# EAGLE design HUMA (EAGLE 5.10)
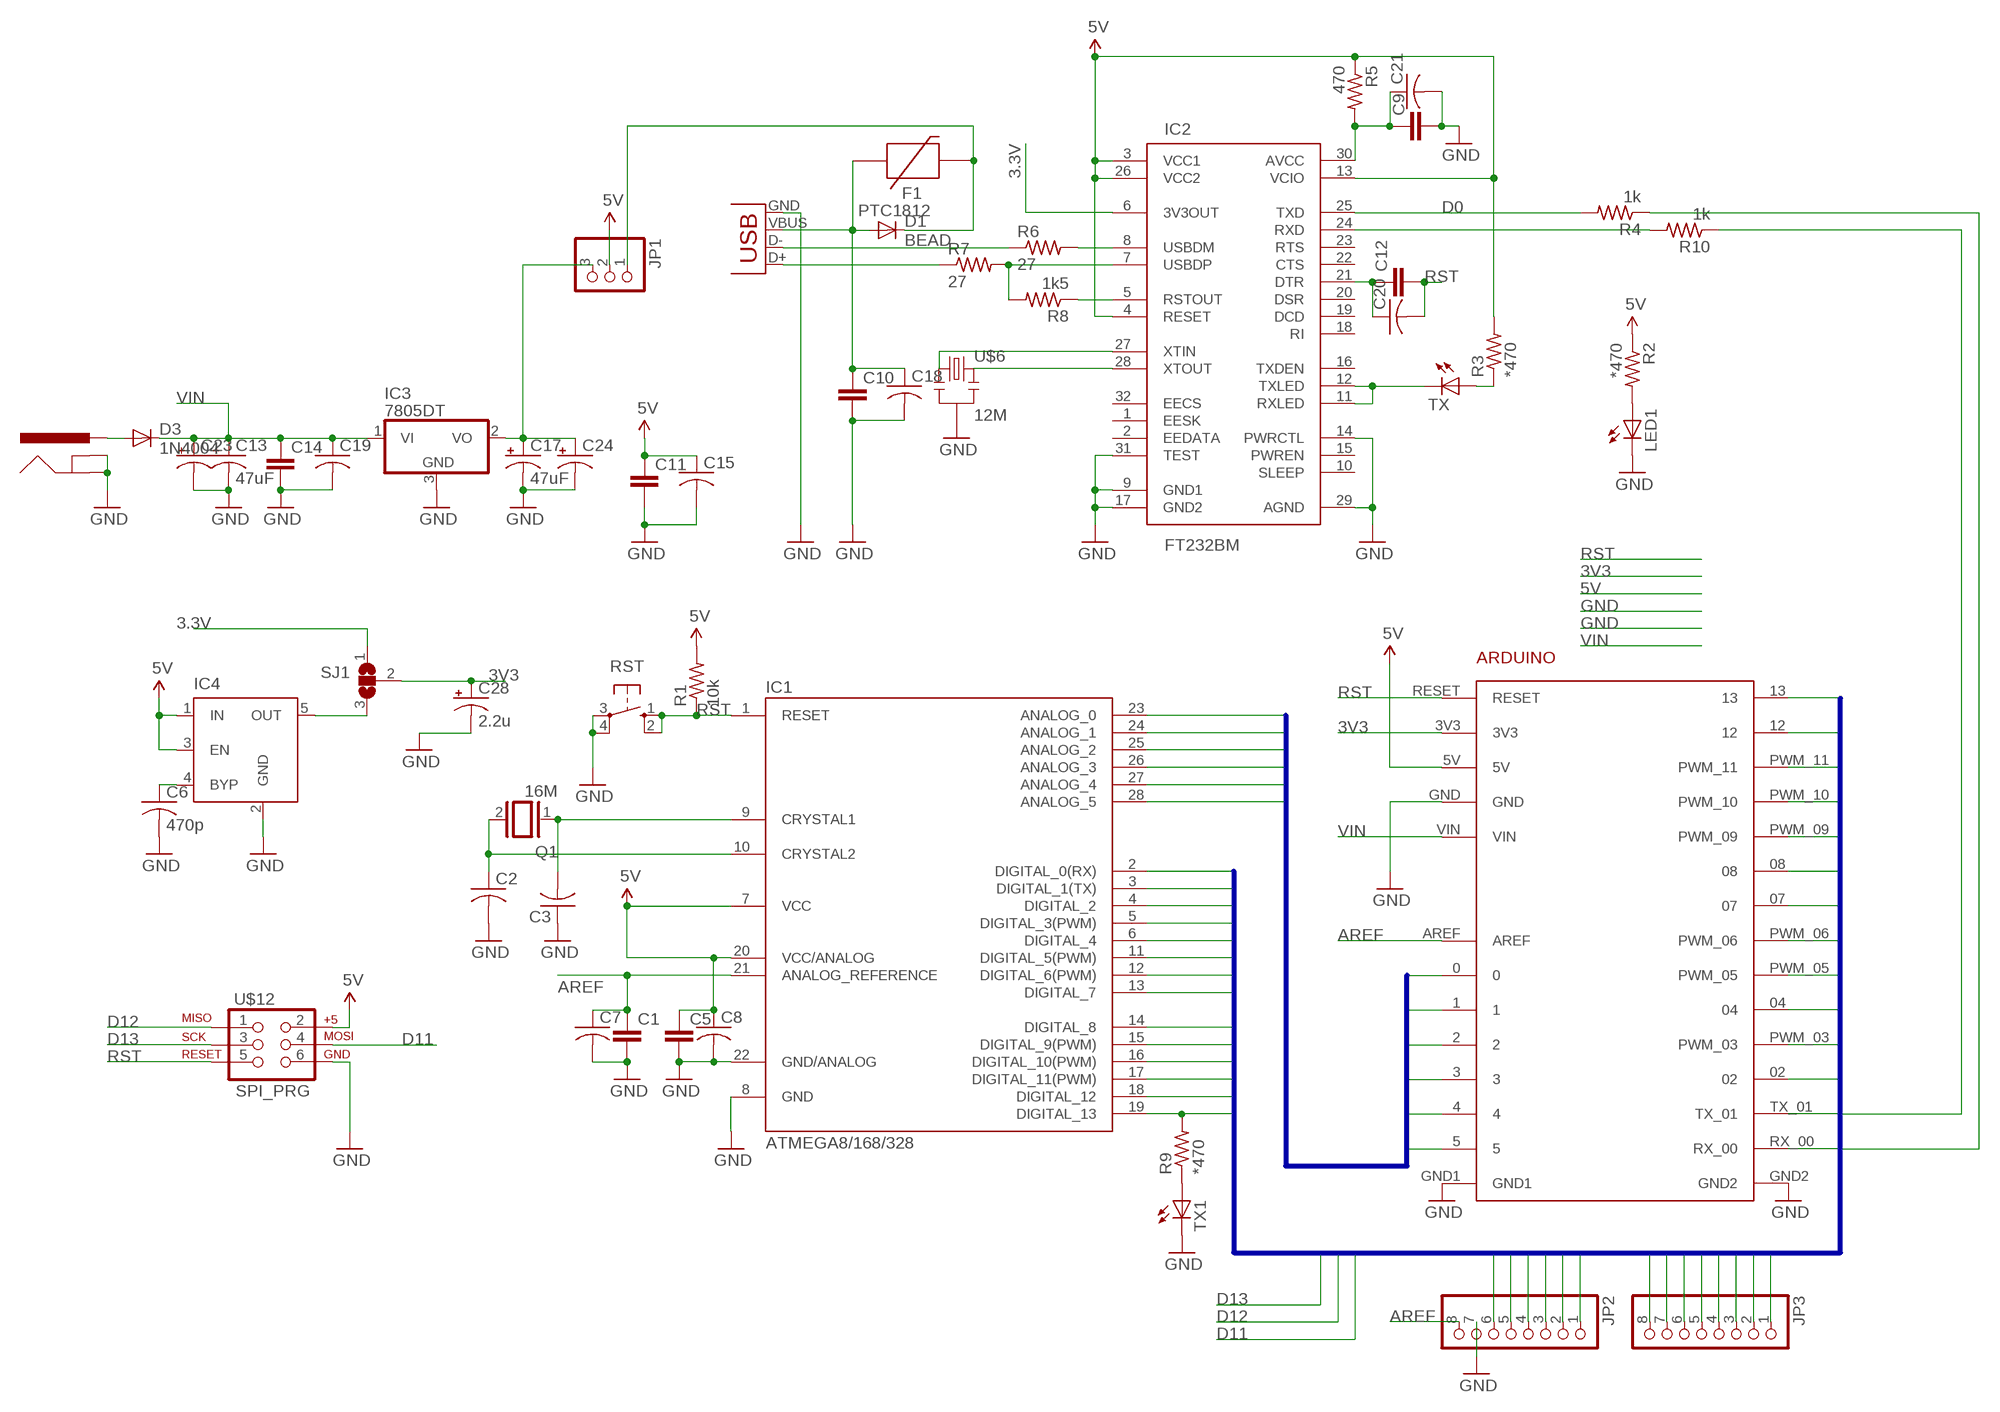
[diagram p0: schematic, sheet 1]

## Parts
ARDUINO1  ARDUINO2  [ARDUINO2]
C1  C5/2.5  [C5B2.5]
C2  C-US025-025X050  [C025-025X050]
C3  C-US025-025X050  [C025-025X050]
C5  C5/2.5  [C5B2.5]
C6  470p  C-US025-025X050  [C025-025X050]
C7  C-USC0603K  [C0603K]
C8  C-USC0603K  [C0603K]
C9  C5/2.5  [C5B2.5]
C10  C5/2.5  [C5B2.5]
C11  C5/2.5  [C5B2.5]
C12  C5/2.5  [C5B2.5]
C13  47uF  CPOL-USE2.5-7  [E2,5-7]
C14  C5/2.5  [C5B2.5]
C15  C-USC0603K  [C0603K]
C17  47uF  CPOL-USE2.5-7  [E2,5-7]
C18  C-USC0603K  [C0603K]
C19  C-USC0603K  [C0603K]
C20  C-USC0603K  [C0603K]
C21  C-USC0603K  [C0603K]
C23  CPOL-US153CLV-0605  [153CLV-0605]
C24  CPOL-US153CLV-0605  [153CLV-0605]
C28  2.2u  CPOL-USA/3216-18W  [A/3216-18W]
D1  BEAD  1N4004  [DO41-10]
D3  1N4004  [DO41-10]
F1  PTC1812  [C1812]
IC1  ATMEGA8/168/328  ATMEGA168-PU  [DIL28-3]
IC2  FT232BM  [QFP-32]
IC3  7805DT  [TO252]
IC4  MIC5219XX  [SOT23-5]
J1  POWER_JACKPTH  [POWER_JACK_PTH]
JP1  PINHD-1X3  [1X03]
JP2  PINHD-1X8  [1X08]
JP3  PINHD-1X8  [1X08]
LED1  LED3MM  [LED3MM]
Q1  16M  XTAL/S  [QS]
R1  10k  R-US_0207/7  [0207/7]
R2  *470  R-US_0207/7  [0207/7]
R3  *470  R-US_0207/7  [0207/7]
R4  1k  R-US_0207/7  [0207/7]
R5  470  R-US_0207/7  [0207/7]
R6  27  R-US_0207/7  [0207/7]
R7  27  R-US_0207/7  [0207/7]
R8  1k5  R-US_0207/7  [0207/7]
R9  *470  R-US_0207/7  [0207/7]
R10  1k  R-US_0207/7  [0207/7]
RST  10-XX  [B3F-10XX]
SJ1  SOLDERJUMPER_2WAYT  [SJ_2]
TX  LED3MM  [LED3MM]
TX1  LED3MM  [LED3MM]
U$6  12M  RESONATORPTH  [RESONATOR-PTH]
U$12  SPI_PRG  AVR_SPI_PRG_6PTH  [2X3]
X1  USB  [USB-B-PTH]

## Nets
3.3V: IC2.6(3V3OUT) SJ1.1
3V3: ARDUINO1.3V3 C28.+ SJ1.2
5V: ARDUINO1.5V C5.1 C8.1 C11.1 C15.1 IC1.7(VCC) IC1.20(VCC/ANALOG) IC2.3(VCC1) IC2.4(RESET) IC2.13(VCIO) IC2.26(VCC2) IC4.1(IN) IC4.3(EN) JP1.2 R1.2 R2.1 R3.2 R5.1 U$12.2
A0: ARDUINO1.0 IC1.23(ANALOG_0)
A1: ARDUINO1.1 IC1.24(ANALOG_1)
A2: ARDUINO1.2 IC1.25(ANALOG_2)
A3: ARDUINO1.3 IC1.26(ANALOG_3)
A4: ARDUINO1.4 IC1.27(ANALOG_4)
A5: ARDUINO1.5 IC1.28(ANALOG_5)
AREF: ARDUINO1.AREF C1.1 C7.1 IC1.21(ANALOG_REFERENCE) JP2.8
D0: ARDUINO1.RX_00 IC1.2(DIGITAL_0(RX)) JP3.1 R4.1
D1: ARDUINO1.TX_01 IC1.3(DIGITAL_1(TX)) JP3.2 R10.1
D2: ARDUINO1.02 IC1.4(DIGITAL_2) JP3.3
D3: ARDUINO1.PWM_03 IC1.5(DIGITAL_3(PWM)) JP3.4
D4: ARDUINO1.04 IC1.6(DIGITAL_4) JP3.5
D5: ARDUINO1.PWM_05 IC1.11(DIGITAL_5(PWM)) JP3.6
D6: ARDUINO1.PWM_06 IC1.12(DIGITAL_6(PWM)) JP3.7
D7: ARDUINO1.07 IC1.13(DIGITAL_7) JP3.8
D8: ARDUINO1.08 IC1.14(DIGITAL_8) JP2.1
D9: ARDUINO1.PWM_09 IC1.15(DIGITAL_9(PWM)) JP2.2
D10: ARDUINO1.PWM_10 IC1.16(DIGITAL_10(PWM)) JP2.3
D11: ARDUINO1.PWM_11 IC1.17(DIGITAL_11(PWM)) JP2.4 U$12.4
D12: ARDUINO1.12 IC1.18(DIGITAL_12) JP2.5 U$12.1
D13: ARDUINO1.13 IC1.19(DIGITAL_13) JP2.6 R9.2 U$12.3
GND: ARDUINO1.GND ARDUINO1.GND1 ARDUINO1.GND2 C1.2 C2.2 C3.1 C5.2 C6.2 C7.2 C8.2 C9.2 C10.2 C11.2 C13.- C14.2 C15.2 C17.- C18.2 C19.2 C21.2 C23.- C24.- C28.- IC1.8(GND) IC1.22(GND/ANALOG) IC2.9(GND1) IC2.14(PWRCTL) IC2.17(GND2) IC2.29(AGND) IC2.31(TEST) IC3.3(GND) IC4.2(GND) J1.GND J1.GNDBREAK JP2.7 LED1.K(C) RST.3(P) RST.4(P1) TX1.K(C) U$6.2 U$12.6 X1.GND
N$1: D1.C F1.2 JP1.1
N$2: C12.1 C20.1 IC2.21(DTR)
N$3: D3.A J1.PWR
N$4: C17.+ C24.+ IC3.2(VO) JP1.3
N$5: IC2.28(XTOUT) U$6.3
N$6: IC2.24(RXD) R10.2
N$7: IC2.25(TXD) R4.2
N$10: IC4.5(OUT) SJ1.3
N$13: R9.1 TX1.A
N$14: C6.1 IC4.4(BYP)
N$21: LED1.A R2.2
N$22: C3.2 IC1.9(CRYSTAL1) Q1.1
N$23: C2.1 IC1.10(CRYSTAL2) Q1.2
N$24: R6.1 X1.D-
N$25: R7.1 X1.D+
N$27: R3.1 TX.A
N$30: IC2.11(RXLED) IC2.12(TXLED) TX.K(C)
N$32: IC2.27(XTIN) U$6.1
N$33: C9.1 C21.1 IC2.30(AVCC) R5.2
N$34: IC2.7(USBDP) R7.2 R8.2
N$35: IC2.8(USBDM) R6.2
N$36: IC2.5(RSTOUT) R8.1
RST: ARDUINO1.RESET C12.2 C20.2 IC1.1(RESET) R1.1 RST.1(S) RST.2(S1) U$12.5
VBUS: C10.1 C18.1 D1.A F1.1 X1.VBUS
VIN: ARDUINO1.VIN C13.+ C14.1 C19.1 C23.+ D3.C IC3.1(VI)
Unconnected: IC2.1(EESK) IC2.2(EEDATA) IC2.10(SLEEP) IC2.15(PWREN) IC2.16(TXDEN) IC2.18(RI) IC2.19(DCD) IC2.20(DSR) IC2.22(CTS) IC2.23(RTS) IC2.32(EECS)

## Buses
D[0..13]
A[0..5]

## Library data of the parts
ARDUINO1 = arduino:ARDUINO: For creating Arduino shields
C1 C5 C9-C12 C14 = capacitor-wima:C: CAPACITOR naming: grid - package width
C2 C3 = rcl:C-US: CAPACITOR, American symbol
C6-C8 C15 C18-C21 = rcl-ez:C-US: CAPACITOR, American symbol
C13 C17 C23 C24 = rcl:CPOL-US: POLARIZED CAPACITOR, American symbol
C28 = rcl-ez:CPOL-US: POLARIZED CAPACITOR, American symbol
D1 D3 = diode:1N4004: DIODE general purpose rectifier, 1 A
F1 = SparkFunEagle-6-6-07:PTC: Resettable Fuse PTC Resettable Fuse. Spark Fun Electronics SKU : COM-08357
IC1 = Arduino-AVR:ATMEGA168-PU
IC2 = FTDI:FT232BM: FT232BM USB-RS232 Wandler FTDI
IC3 = linear:78*: Positive VOLTAGE REGULATOR Source: http://cache.national.com/ds/LM/LM78L05.pdf http://www.fairchildsemi.com/ds/LM/LM7805.pdf
IC4 = v-reg-micrel:MIC5219XX: VOLTAGE REGULATOR
J1 = SparkFun:POWER_JACK: Power Jack This is the standard 5.5mm barrel jack for power. The PTH is the most common, proven, reliable, footprint. All others are experimental. The Slot footprint only works if the mill layer is transmitted to the PCB fab house so be warned. Spark Fun Electronics SKU : PRT-00119. Mating wall wart : TOL-00298 (and others)
JP1 = pinhead:PINHD-1X3: PIN HEADER
JP2 JP3 = pinhead:PINHD-1X8: PIN HEADER
LED1 TX TX1 = led:LED: LED OSRAM: - CHIPLED LG R971, LG N971, LY N971, LG Q971, LY Q971, LO R971, LY R971 LH N974, LH R974 LS Q976, LO Q976, LY Q976 LO Q996 - Hyper CHIPLED LW Q18S LB Q993, LB Q99A, LB R99A - SideLED LS A670, LO A670, LY A670, LG A670, LP A670 LB A673, LV A673, LT A673, LW A673 LH A674 LY A675 LS A676, LA A676, LO A676, LY A676, LW A676 LS A679, LY A679, LG A679 - Hyper Micro SIDELED® LS Y876, LA Y876, LO Y876, LY Y876 LT Y87S - SmartLED LW L88C, LW L88S LB L89C, LB L89S, LG L890 LS L89K, LO L89K, LY L89K LS L896, LA L896, LO L896, LY L896 - TOPLED LS T670, LO T670, LY T670, LG T670, LP T670 LSG T670, LSP T670, LSY T670, LOP T670, LYG T670 LG T671, LOG T671, LSG T671 LB T673, LV T673, LT T673, LW T673 LH T674 LS T676, LA T676, LO T676, LY T676, LB T676, LH T676, LSB T676, LW T676 LB T67C, LV T67C, LT T67C, LS T67K, LO T67K, LY T67K, LW E67C LS E67B, LA E67B, LO E67B, LY E67B, LB E67C, LV E67C, LT E67C LW T67C LS T679, LY T679, LG T679 LS T770, LO T770, LY T770, LG T770, LP T770 LB T773, LV T773, LT T773, LW T773 LH T774 LS E675, LA E675, LY E675, LS T675 LS T776, LA T776, LO T776, LY T776, LB T776 LHGB T686 LT T68C, LB T68C - Hyper Mini TOPLED® LB M676 - Mini TOPLED Santana® LG M470 LS M47K, LO M47K, LY M47K Source: http://www.osram.convergy.de - LUMILED® LXK2-PW12-R00, LXK2-PW12-S00, LXK2-PW14-U00, LXK2-PW14-V00 LXK2-PM12-R00, LXK2-PM12-S00, LXK2-PM14-U00 LXK2-PE12-Q00, LXK2-PE12-R00, LXK2-PE12-S00, LXK2-PE14-T00, LXK2-PE14-U00 LXK2-PB12-K00, LXK2-PB12-L00, LXK2-PB12-M00, LXK2-PB14-N00, LXK2-PB14-P00, LXK2-PB14-Q00 LXK2-PR12-L00, LXK2-PR12-M00, LXK2-PR14-Q00, LXK2-PR14-R00 LXK2-PD12-Q00, LXK2-PD12-R00, LXK2-PD12-S00 LXK2-PH12-R00, LXK2-PH12-S00 LXK2-PL12-P00, LXK2-PL12-Q00, LXK2-PL12-R00 Source: www.luxeon.com
Q1 = special:XTAL/S: CRYSTAL
R1 R2 = rcl:R-US_: RESISTOR, American symbol
R3-R10 = resistor:R-US_: RESISTOR, American symbol
RST = switch-omron:10-XX: OMRON SWITCH
SJ1 = SparkFun:SOLDERJUMPER_2WAY: Solder Jumper 2 way solder jumper
U$6 = SparkFun:RESONATOR: Resonator Small SMD resonator. This is the itty bitty 10/20MHz resonators with built in caps. CSTCE10M0G55 and CSTCE20M0V53. Footprint has been reviewed closely but hasn't been tested yet.
U$12 = SparkFun:AVR_SPI_PRG_6: AVR ISP 6 Pin This is the reduced ISP connector for AVR programming. Common on Arduino. This footprint will take up less PCB space and can be used with a 10-pin to 6-pin adapter such as SKU: BOB-08508
X1 = SparkFun:USB: USB Connectors USB-B-PTH is fully proven SKU : PRT-00139 USB-miniB is fully proven SKU : PRT-00587 USB-A-H is throughly reviewed, but untested. Spark Fun Electronics SKU : PRT-00437 USB-B-SMT is throughly reviewed, but untested. Needs silkscreen touching up. USB-A-S has not been used/tested USB-MB-H has not been used/tested

## Board
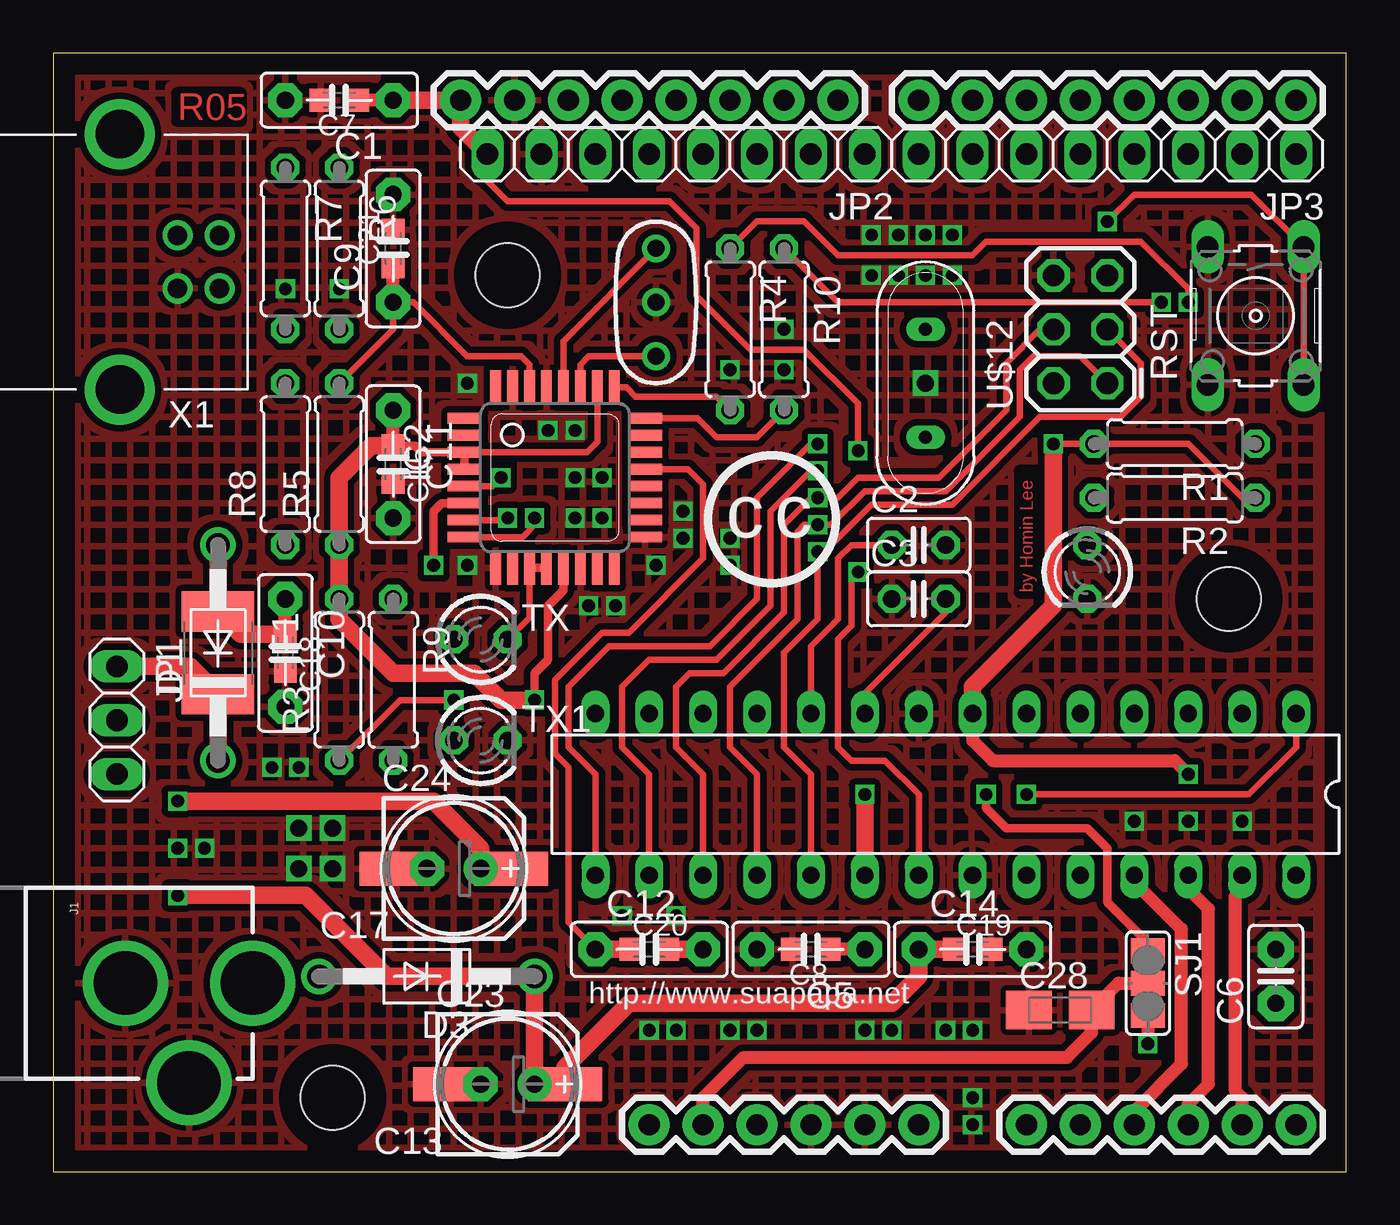
[diagram p1: board, top side]
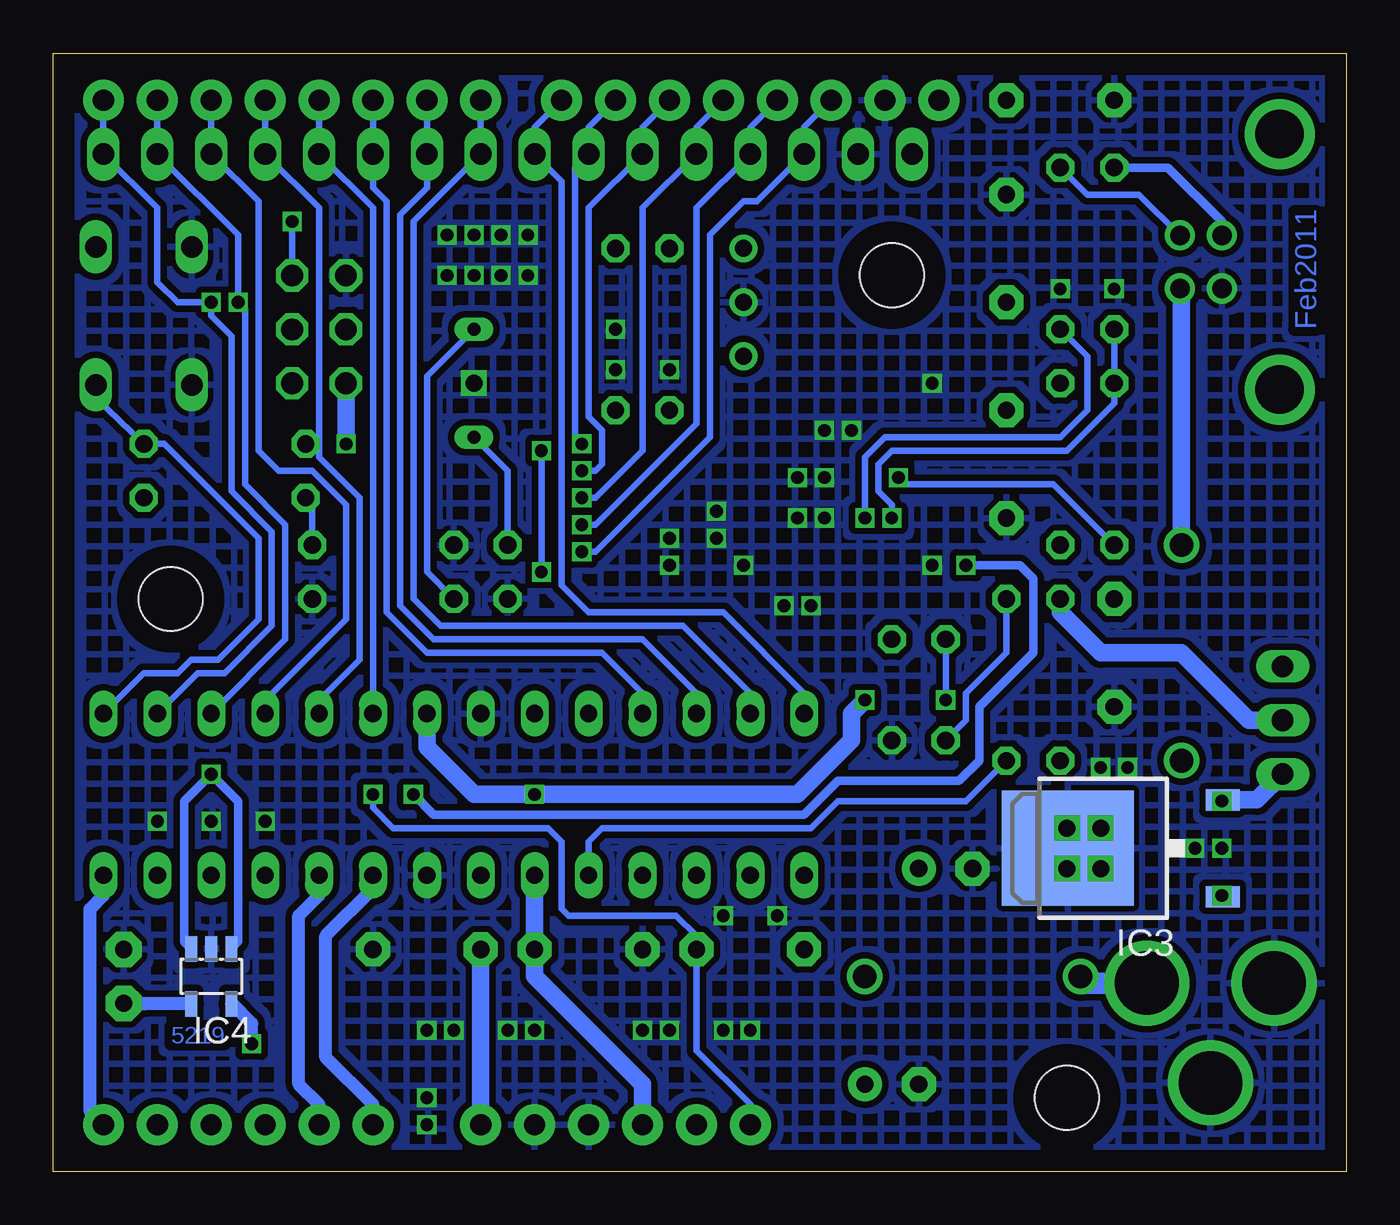
[diagram p2: board, bottom side, seen from below]

Size 60.95 x 52.7 mm. Coordinates in mm from the lower left corner, seen from the top.
Outline: 60.95,52.7 0,52.7 0,0 60.95,0 60.95,52.7
Copper layers (1*16): Top 0.035mm / dielectric 1.5mm / Bottom 0.035mm
Design rules "default *": minimum track width 10mil, minimum drill 16mil, track to track 10mil, track to pad 10mil, pad to pad 8mil, via to via 8mil, smd to smd 8mil, copper to edge 40mil, drill to drill 8mil, minimum pad ring 10mil, minimum via ring 4mil, stop-mask expansion 4mil, vias tented up to drill 0mil, thermal gap 10mil
Holes 3 mm at 55.4,26.98 13.17,3.49 21.43,42.22

### Footprints (pad centres in the part's own frame; a part is rotated, then mirrored left to right if it is on the bottom)
ARDUINO2 = drill 1 pad 1.93 round: 0 0,12.7; 1 0,10.16; 2 0,7.62; 02 48.26,5.08; 3 0,5.08; 3V3 0,27.94; 4 0,2.54; 04 48.26,10.16; 5 0,0; 5V 0,25.4; 07 48.26,17.78; 08 48.26,21.59; 12 48.26,31.75; 13 48.26,34.29; AREF 48.26,39.37; GND 0,22.86; GND1 0,20.32; GND2 48.26,36.83; PWM_03 48.26,7.62; PWM_05 48.26,12.7; PWM_06 48.26,15.24; PWM_09 48.26,24.13; PWM_10 48.26,26.67; PWM_11 48.26,29.21; RESET 0,30.48; RX_00 48.26,0; TX_01 48.26,2.54; VIN 0,17.78
C5B2.5 = drill 0.813 pad 1.6 octagon: 1 -2.54,0; 2 2.54,0
C025-025X050 = drill 0.813 octagon: 1 -1.27,0; 2 1.27,0
C025-025X050' = drill 0.813 pad 1.676 octagon: 1 -1.27,0; 2 1.27,0
C0603K = smd 1.05 x 1.08: 1 -0.875,0; 2 0.875,0
E2,5-7 = drill 0.813 pad 1.6 round: + -1.27,0 | drill 0.813 pad 1.6 octagon: - 1.27,0
153CLV-0605 = smd 3.5 x 1.6: + 2.7,0; - -2.7,0
A/3216-18W = smd 2.15 x 1.8: + 1.475,0; - -1.475,0
DO41-10 = drill 1.118 round: A 5.08,0; C -5.08,0
C1812 = smd 1.9 x 3.4: 1 -1.95,0; 2 1.95,0
DIL28-3 = drill 0.813 long: 1 -16.51,-3.81; 2 -13.97,-3.81; 3 -11.43,-3.81; 4 -8.89,-3.81; 5 -6.35,-3.81; 6 -3.81,-3.81; 7 -1.27,-3.81; 8 1.27,-3.81; 9 3.81,-3.81; 10 6.35,-3.81; 11 8.89,-3.81; 12 11.43,-3.81; 13 13.97,-3.81; 14 16.51,-3.81; 15 16.51,3.81; 16 13.97,3.81; 17 11.43,3.81; 18 8.89,3.81; 19 6.35,3.81; 20 3.81,3.81; 21 1.27,3.81; 22 -1.27,3.81; 23 -3.81,3.81; 24 -6.35,3.81; 25 -8.89,3.81; 26 -11.43,3.81; 27 -13.97,3.81; 28 -16.51,3.81
QFP-32 = smd 0.508 x 1.6: 1 -2.8,-4.25; 2 -2,-4.25; 3 -1.2,-4.25; 4 -0.4,-4.25; 5 0.4,-4.25; 6 1.2,-4.25; 7 2,-4.25; 8 2.8,-4.25; 17 2.8,4.25; 18 2,4.25; 19 1.2,4.25; 20 0.4,4.25; 21 -0.4,4.25; 22 -1.2,4.25; 23 -2,4.25; 24 -2.8,4.25 | smd 1.6 x 0.508: 9 4.25,-2.8; 10 4.25,-2; 11 4.25,-1.2; 12 4.25,-0.4; 13 4.25,0.4; 14 4.25,1.2; 15 4.25,2; 16 4.25,2.8; 25 -4.25,2.8; 26 -4.25,2; 27 -4.25,1.2; 28 -4.25,0.4; 29 -4.25,-0.4; 30 -4.25,-1.2; 31 -4.25,-2; 32 -4.25,-2.8
TO252 = smd 1 x 1.6: 1 -2.28,-4.8; 2 2.28,-4.8 | smd 5.4 x 6.2: 3 0,2.5
SOT23-5 = smd 0.55 x 1.2: 1 -0.95,-1.3; 2 0,-1.3; 3 0.95,-1.3; 4 0.95,1.3; 5 -0.95,1.3
POWER_JACK_PTH = drill 2.997 round: GND 0,7.7; GNDBREAK 4.7,10.7; PWR 0,13.7
1X03 = drill 1.016 long: 1 -2.54,0; 2 0,0; 3 2.54,0
1X08 = drill 1.016 long: 1 -8.89,0; 2 -6.35,0; 3 -3.81,0; 4 -1.27,0; 5 1.27,0; 6 3.81,0; 7 6.35,0; 8 8.89,0
LED3MM = drill 0.813 octagon: A -1.27,0; K 1.27,0
QS = drill 0.61 long: 1 -2.54,0; 2 2.54,0
0207/7 = drill 0.813 octagon: 1 -3.81,0; 2 3.81,0
B3F-10XX = drill 1.016 long: 1 -3.251,2.261; 2 3.251,2.261; 3 -3.251,-2.261; 4 3.251,-2.261
SJ_2 = smd 1.168 x 1.6: 1 -1.524,0; 2 0,0; 3 1.524,0
RESONATOR-PTH = drill 0.8 round: 1 -2.54,0; 2 0,0; 3 2.54,0
2X3 = drill 1.016 octagon: 1 0,0; 2 0,2.54; 3 2.54,0; 4 2.54,2.54; 5 5.08,0; 6 5.08,2.54
USB-B-PTH = drill 0.914 round: D+ 0,1.25; D- 1.981,1.25; GND 0,-1.25; VBUS 1.981,-1.25 | drill 2.286 round: P$1 -2.718,-6.02; P$2 -2.718,6.02

### Placement (x,y rotation side)
ARDUINO1  58.57,2.22 90 top
C1  13.49,50.48 180 top
C2  40.79,29.52 0 top
C3  40.79,26.98 0 top
C5  35.71,10.47 180 top
C6  470p  [C025-025X050']  57.62,9.2 90 top
C7  13.49,50.48 180 top
C8  35.71,10.47 180 top
C9  16.03,43.49 90 top
C10  10.95,24.44 270 top
C11  16.03,33.33 270 top
C12  28.09,10.47 0 top
C13  21.43,4.12 180 top
C14  43.33,10.47 0 top
C15  16.03,33.33 270 top
C17  18.88,14.28 180 top
C18  10.95,24.44 270 top
C19  43.33,10.47 0 top
C20  28.09,10.47 0 top
C21  16.03,43.49 90 top
C23  21.43,4.12 0 top
C24  18.88,14.28 0 top
C28  47.46,7.62 0 top
D1  7.77,24.44 90 top
D3  17.62,9.2 180 top
F1  7.77,24.44 270 top
IC1  42.06,17.78 180 top
IC2  23.65,32.7 270 top
IC3  10.63,15.23 90 bottom
IC4  53.49,9.2 180 bottom
J1  -4.29,8.88 270 top
JP1  3.01,21.27 270 top
JP2  29.36,47.94 180 top
JP3  49.68,47.94 180 top
LED1  48.73,28.25 270 top
Q1  41.11,37.14 270 top
R1  52.86,34.28 180 top
R2  52.86,31.75 180 top
R3  13.49,23.17 90 top
R4  31.9,39.68 270 top
R5  13.49,33.33 90 top
R6  13.49,43.49 270 top
R7  10.95,43.49 270 top
R8  10.95,33.33 90 top
R9  16.03,23.17 270 top
R10  34.44,39.68 270 top
RST  56.67,40.32 270 top
SJ1  51.59,8.88 270 top
TX  20.16,25.08 0 top
TX1  20.16,20.32 0 top
U$6  28.41,40.95 90 top
U$8  [CC-LOGO]  34.77,31.35 0 top
U$12  49.68,37.14 90 top
X1  5.87,42.86 0 top

### Tracks (layer width: path | path; a pad name or v marks a point on that pad's centre or on a via)
3.3V  (via drill 0.6)
  Top 0.406: v43.97,17.78 43.97,17.14 44.92,16.19 48.73,16.19 49.68,15.23 49.68,12.69 51.59,10.79 SJ1.1 | IC2.6 18.32,31.5 17.93,31.11 v17.93,28.57
  Bottom 0.406: v43.97,17.78 43.02,16.82 25.55,16.82 23.97,18.41 18.25,18.41 17.3,19.36 17.3,21.9 14.76,24.44 14.76,27.94 15.39,28.57 v17.93,28.57
3V3
  Top 0.61: C28.+ 48.21,7.62 | SJ1.2 50.2,8.88 C28.+ | C28.+ 48.94,6.55 47.78,5.39 32.54,5.39 30.63,3.49 ARDUINO1.3V3
5V  (via drill 0.6)
  Top 0.305: v47.14,34.28 R1.2 53.49,34.28 56.03,31.75 R2.1 | IC2.3 25.16,33.9 25.65,34.38 IC2.26
  Top 0.406: IC2.4 IC2.3 17.37,33.9 17.06,34.21 C15.1 | IC2.13 24.05,27.38 23.33,26.67 23.33,24.12 22.7,23.49 v22.7,22.22
  Top 0.61: C5.1 C8.1 | C15.1 C11.1 | IC1.7 43.33,20.32 44.29,19.36 52.86,19.36 v53.49,18.73
  Top 0.813: v38.25,17.78 IC1.20 | IC1.7 43.33,22.86 47.14,26.67 v47.14,34.28 | C15.1 15,34.21 13.49,32.7 R5.1 R3.2 13.49,26.03 16.03,23.49 19.84,23.49 21.11,22.22 v22.7,22.22
  Bottom 0.406: IC4.3 54.76,10.82 54.76,17.46 v53.49,18.73 52.22,17.46 52.22,10.82 IC4.1
  Bottom 0.813: IC1.7 43.33,20 41.11,17.78 v38.25,17.78 25.87,17.78 23.33,20.32 23.33,21.59 v22.7,22.22 | IC1.20 C5.1 38.25,9.2 33.17,4.12 ARDUINO1.5V | v47.14,34.28 U$12.2 | R3.2 13.49,26.35 11.58,24.44 7.77,24.44 4.6,21.27 JP1.2
A0
  Bottom 0.61: IC1.23 45.87,13.33 48.09,11.11 48.09,5.39 45.87,3.17 ARDUINO1.0
A1
  Bottom 0.61: ARDUINO1.1 48.41,3.17 49.37,4.12 49.37,12.06 48.41,13.01 IC1.24
A2
  Top 0.61: ARDUINO1.2 50.95,2.85 53.17,5.08 53.17,11.42 50.95,13.65 IC1.25
A3
  Top 0.61: ARDUINO1.3 53.49,3.17 54.45,4.12 54.45,12.38 53.49,13.33 IC1.26
A4
  Top 0.61: IC1.27 56.03,13.33 55.72,13.01 55.72,3.81 56.03,3.49 ARDUINO1.4
A5
  Bottom 0.61: IC1.28 58.57,13.01 59.21,12.38 59.21,2.85 ARDUINO1.5
AREF  (via drill 0.6)
  Top 0.305: IC1.21 40.79,17.78 39.2,19.36 37.62,19.36 36.98,20 36.98,25.08 37.62,25.71 37.62,27.94 v37.94,28.25 | JP2.8 20.47,46.67 21.43,45.71 29.05,45.71 30.31,44.45 30.31,41.27 32.86,38.73 35.4,38.73 37.94,36.19 v37.94,33.97
  Top 0.61: C1.1 C7.1
  Top 0.813: C1.1 ARDUINO1.AREF 19.2,49.21 JP2.8
  Bottom 0.305: v37.94,28.25 v37.94,33.97
D0  (via drill 0.6)
  Top 0.305: v53.49,40.95 53.49,41.59 51.27,43.81 43.97,43.81 43.33,43.17 36.98,43.17 35.4,44.76 33.17,44.76 R4.1
  Bottom 0.305: ARDUINO1.RX_00 JP3.1 56.03,45.4 56.03,41.9 55.08,40.95 v53.49,40.95 53.49,40.32 52.54,39.36 52.54,32.06 50.63,30.16 50.63,25.71 52.86,23.49 54.13,23.49 IC1.2
D1  (via drill 0.6)
  Top 0.305: v52.22,40.95 36.98,40.95 R10.1
  Bottom 0.305: ARDUINO1.TX_01 JP3.2 52.22,44.13 v52.22,40.95 51.91,40.63 51.91,32.38 50,30.48 50,25.08 IC1.3
D2
  Bottom 0.305: IC1.4 50.95,22.22 47.14,26.03 47.14,31.43 48.73,33.02 50.32,33.02 51.27,33.97 51.27,45.71 JP3.3 ARDUINO1.02
D3
  Bottom 0.305: IC1.5 48.41,22.22 46.51,24.12 46.51,31.75 48.41,33.65 48.41,45.4 JP3.4 ARDUINO1.PWM_03
D4
  Bottom 0.305: IC1.6 45.87,45.4 JP3.5 ARDUINO1.04
D5
  Bottom 0.305: IC1.11 33.17,22.54 35.08,24.44 43.33,24.44 45.24,26.35 45.24,45.71 45.87,46.35 JP3.6 ARDUINO1.PWM_05
D6
  Bottom 0.305: IC1.12 30.63,22.54 33.17,25.08 43.02,25.08 44.6,26.67 44.6,45.08 43.33,46.35 JP3.7 ARDUINO1.PWM_06
D7
  Bottom 0.305: IC1.13 28.09,22.54 31.27,25.71 42.7,25.71 43.97,26.98 43.97,44.76 JP3.8 ARDUINO1.07
D8
  Bottom 0.305: IC1.14 25.55,22.54 29.36,26.35 35.71,26.35 36.98,27.62 36.98,46.67 JP2.1 38.25,49.21 ARDUINO1.08
D9  (via drill 0.6)
  Top 0.305: IC1.15 25.55,18.73 24.28,20 24.28,22.86 26.19,24.76 30.95,24.76 33.17,26.98 33.17,31.75 35.71,34.28 v36.03,34.28
  Bottom 0.305: v36.03,34.28 36.35,34.6 36.35,47.3 JP2.2 35.71,49.21 ARDUINO1.PWM_09
D10  (via drill 0.6)
  Top 0.305: IC1.16 28.09,18.73 26.82,20 26.82,22.86 28.09,24.12 31.27,24.12 33.81,26.67 33.81,31.11 35.71,33.02 v36.03,33.02
  Bottom 0.305: ARDUINO1.PWM_10 33.17,49.21 JP2.3 35.71,45.4 35.71,35.55 35.08,34.92 35.08,33.33 35.4,33.02 v36.03,33.02
D11  (via drill 0.6)
  Top 0.305: IC1.17 30.63,18.73 29.36,20 29.36,22.86 30,23.49 31.59,23.49 34.44,26.35 34.44,30.48 35.71,31.75 v36.03,31.75 36.98,31.75 37.94,32.7 41.75,32.7 44.92,35.87 44.92,38.09 46.51,39.68 U$12.4
  Bottom 0.305: v36.03,31.75 35.4,31.75 33.17,33.97 33.17,45.4 JP2.4 30.63,49.21 ARDUINO1.PWM_11
D12  (via drill 0.6)
  Top 0.305: IC1.18 33.17,18.73 31.9,20 31.9,22.86 35.08,26.03 35.08,30.16 35.4,30.48 v36.03,30.48 36.66,30.48 38.25,32.06 42.06,32.06 45.55,35.55 45.55,37.78 46.19,38.41 48.41,38.41 U$12.1
  Bottom 0.305: v36.03,30.48 35.4,30.48 30.63,35.24 30.63,45.4 JP2.5 28.09,49.21 ARDUINO1.12
D13  (via drill 0.6)
  Top 0.305: IC1.19 35.71,18.73 34.44,20 34.44,24.44 36.03,26.03 v36.03,29.21 36.35,29.21 38.57,31.43 42.38,31.43 46.51,35.55 50.32,35.55 51.27,36.51 51.27,38.09 U$12.3
  Bottom 0.305: IC1.19 35.71,15.55 35.08,16.19 25.23,16.19 23.97,17.46 17.93,17.46 R9.2 | ARDUINO1.13 25.55,49.21 JP2.6 27.77,45.71 28.41,45.71 30,44.13 30,34.6 35.4,29.21 v36.03,29.21
GND  (via drill 0.6, 0.8)
  other vias: 24.6,32.7 24.6,34.92 25.87,30.79 7.14,15.23 5.87,15.23 43.33,3.49 28.41,28.57 19.52,28.57 53.49,16.51 50.95,16.51 56.03,16.51 41.11,37.14 11.58,14.28 13.17,14.28 13.17,16.19 11.58,16.19 43.33,2.22 19.52,37.14 11.58,19.05 10.31,19.05 26.82,12.06 29.36,12.06 38.25,6.66 23.33,34.92 39.52,6.66 33.17,6.66 31.9,6.66 29.36,6.66 28.09,6.66 42.06,6.66 43.33,6.66 38.57,44.13 31.9,37.78 29.68,29.84 29.68,31.11 38.57,42.22 39.84,42.22 39.84,44.13 41.11,42.22 41.11,44.13 42.38,44.13 42.38,42.22 25.87,32.7 24.6,30.79 34.44,39.68 34.44,37.78 31.9,29.84 31.9,28.57 25.23,26.67 26.51,26.67 10.95,41.59 13.49,41.59
  pour Top (isolate 0.305, hatched): -1.44,54.29 62.38,54.29 62.38,-1.27 -1.44,-1.27
  pour Bottom (isolate 0.305, hatched): -0.8,53.34 61.75,53.34 61.75,-0.64 -0.8,-0.64
N$1
  Top 0.813: D1.C F1.2 6.46,23.81 JP1.1
N$2
  Top 0.305: C12.1 24.28,11.74 24.28,19.05 23.65,19.68 23.65,23.17 25.87,25.39 27.14,25.39 30.63,28.89 30.63,32.38 29.91,33.1 IC2.21
  Top 0.813: C12.1 C20.1
N$3
  Bottom 1.016: J1.PWR 12.22,8.88 D3.A
N$4  (via drill 0.6)
  Top 0.813: C24.+ C17.+ 20.16,15.23 17.93,17.46 v5.87,17.46
  Bottom 0.813: v5.87,17.46 5.81,17.52 IC3.2 4.22,17.52 JP1.3
N$5
  Top 0.305: IC2.28 24.05,39.13 U$6.3
N$6
  Top 0.305: IC2.24 30.37,35.5 31.27,34.6 33.17,34.6 R10.2
N$7
  Top 0.305: IC2.25 27.02,36.95 27.46,36.51 31.27,36.51 R4.2
N$10  (via drill 0.6)
  Top 0.61: SJ1.3 v51.59,6.03
  Bottom 0.61: IC4.5 52.51,7.9 51.59,6.98 v51.59,6.03
N$13
  Bottom 0.305: R9.1 16.03,24.44 17.93,22.54 17.93,21.27 TX1.A
N$14
  Bottom 0.61: IC4.4 56.64,7.9 C6.1
N$21
  Bottom 0.305: LED1.A 48.73,31.43 R2.2
N$22
  Top 0.305: IC1.9 38.25,22.54 42.06,26.35 C3.2
  Bottom 0.305: Q1.1 43.33,37.46 43.33,28.25 C3.2
N$23
  Top 0.305: C2.1 37.62,29.52 36.98,28.89 36.98,26.03 35.71,24.76 IC1.10
  Bottom 0.305: C2.1 39.52,33.02 Q1.2
N$24
  Bottom 0.305: R6.1 12.22,46.03 9.77,46.03 X1.D-
N$25
  Bottom 0.406: X1.D+ 5.87,44.76 8.41,47.3 R7.1
N$27  (via drill 0.6)
  Top 0.305: R3.1 16.34,22.22 v18.88,22.22
  Bottom 0.305: v18.88,22.22 TX.A
N$30
  Top 0.305: TX.K 22.45,26.1 IC2.11
  Top 0.406: IC2.11 IC2.12
N$32
  Top 0.305: IC2.27 24.85,38.02 25.23,38.41 U$6.1
N$33
  Top 0.305: IC2.30 22.45,38.02 22.06,38.41 19.52,38.41 16.98,40.95 C9.1 16.03,39.68 R5.2
  Top 0.61: C9.1 C21.1
N$34  (via drill 0.6)
  Top 0.305: IC2.7 21.33,30.7 v21.43,30.79
  Bottom 0.305: R7.2 R8.2 10.95,36.19 13.17,33.97 21.43,33.97 22.06,33.33 22.06,32.06 21.43,31.43 v21.43,30.79
N$35  (via drill 0.6)
  Top 0.305: IC2.8 22.12,29.9 22.7,30.48 v22.7,30.79
  Bottom 0.305: v22.7,30.79 22.7,33.65 21.74,34.6 13.49,34.6 12.22,35.87 12.22,38.41 R6.2
N$36  (via drill 0.6)
  Top 0.305: v21.11,32.7 20.71,32.3 IC2.5
  Bottom 0.305: R8.1 13.8,32.38 20.79,32.38 v21.11,32.7
RST  (via drill 0.6)
  Top 0.305: IC1.1 58.57,20 56.35,17.78 v45.87,17.78 | RST.2 RST.1 56.46,46.03 50.95,46.03 v49.68,44.76
  Top 0.813: C12.2 C20.2
  Bottom 0.305: v45.87,17.78 45.87,17.14 44.92,16.19 37.62,16.19 36.98,15.55 36.98,12.38 36.66,12.06 31.59,12.06 30.63,11.11 C12.2 30.63,5.71 28.09,3.17 ARDUINO1.RESET | RST.2 58.93,36.47 R1.1 55.72,34.28 51.27,29.84 51.27,26.03 53.17,24.12 54.45,24.12 55.08,23.49 56.67,23.49 IC1.1 | v49.68,44.76 U$12.5
VBUS
  Top 0.61: C18.1 C10.1
  Top 0.813: D1.A F1.1 8.85,25.32 C18.1
  Bottom 0.813: D1.A 7.77,41.05 X1.VBUS
VIN  (via drill 0.6)
  Top 0.813: C19.1 C14.1 40.79,9.2 39.52,7.93 27.14,7.93 24.12,4.92 C23.+ C13.+ D3.C 15.71,9.2 11.9,13.01 v5.87,13.01
  Bottom 0.813: C14.1 ARDUINO1.VIN | IC3.1 5.81,12.96 v5.87,13.01

### Text on the board
Top: R05 | by Homin Lee
Bottom: Feb2011 | 5219
tPlace: http://www.suapapa.net
tValues: AREF | 13 | 12 | *11 | *10 | *09 | 08 | 07 | *06 | *05 | 04 | *03 | 02 | TX | 01 | RX | 00 | 6M | Made in | Korea | PWR | R/T | HUMA | Freeduino | USB | 5V | L | EXT | USB | 3V3 | LDO | RST | 3V3 | 5V | GND | GND | VIN | A0 | A1 | A2 | A3 | A4 | A5 | 9-12V
Document: TODO: | mod. 16mil lines to 12mil make more room | TODO: | TODO: